# Altium schematic sheet CAN_SN65HVD233.SchDoc
size A3
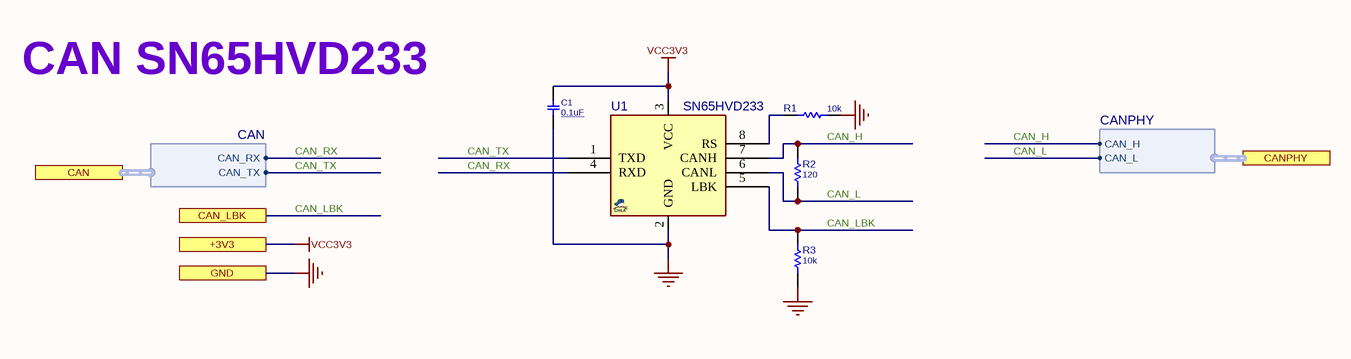
[diagram p0: CAN_SN65HVD233.SchDoc]

## Parts
C1  0.1uF  [C0402]
R1  10k  [R0402]
R2  120  [R0603]
R3  10k  [R0402]
U1  SN65HVD233  [SO_8]

## Ports
+3V3, CAN (harness CAN), CAN_LBK, CANPHY (harness CANPHY), GND

## Harnesses
CANPHY: CAN_H, CAN_L
CAN: CAN_TX, CAN_RX

## Nets
GND: C1.1 R1.1 R3.1 U1.2(GND) ; port GND
VCC3V3: C1.2 U1.3(VCC) ; port +3V3
CAN_H: R2.2 U1.7(CANH) ; port CANPHY.CAN_H
CAN_L: R2.1 U1.6(CANL) ; port CANPHY.CAN_L
CAN_LBK: R3.2 U1.5(LBK) ; port CAN_LBK
CAN_RX: U1.4(RXD) ; port CAN.CAN_RX
CAN_TX: U1.1(TXD) ; port CAN.CAN_TX
NetR1_2: R1.2 U1.8(RS)

## Notes on the sheet
- CAN SN65HVD233
- Title
- Size:
- Date:
- A3
- Number:
- Time:
- Revision:
- Sheet
- of
- File:

## Library data of the parts
C1 = CAP_SMD_MLCC_0402: CAP, MLCC; PARAM: -, -%; MANF_P#: MANF_PART#; PARAM2: 50V; PRICE: 100= 1$; MANF: -; ASSEMBLY: ASSEMBLY; VALUE: 0.1uF
R1-R3 = RES_SMD_0402: RESISTOR, SMD; PARAM: -W; DESC: DESCRIPTION; DIST#: MOUSER; PARAM2: 1%; MANF_P#: -; MANF: -; ASSEMBLY: ASSEMBLY; PRICE: 100= 0.5$
  R1 R3: VALUE: 10k
  R2: VALUE: 120
U1 = SN65HVD233_SOP8: CAN,  Transceivers, 3.3VCC; MANF: Texas Instruments; MANF_P#: SN65HVD233D; PARAM: -40~85oC; PRICE: 3$@MOUSER; PARAM2: 3.3VCC; VALUE: SN65HVD233